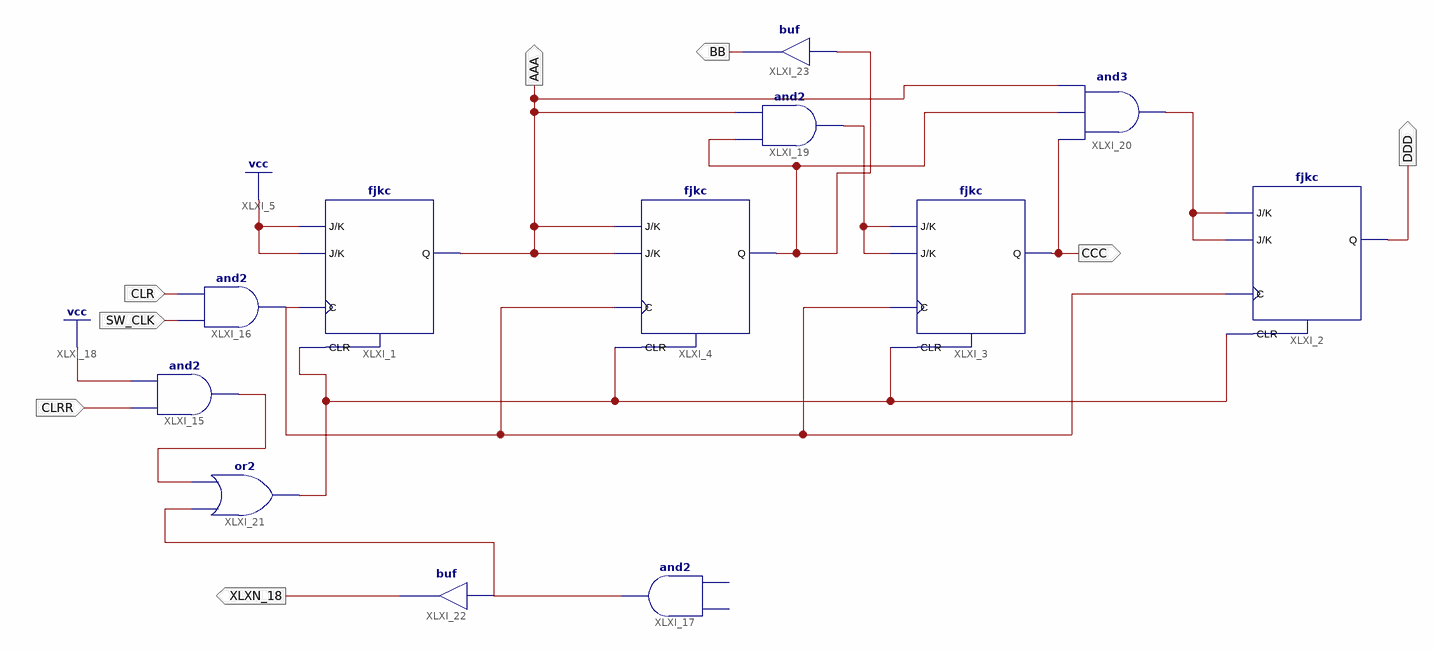
[diagram p0: schematic sheet 1]
// Xilinx ISE schematic COU0_9.sch (spartan6) as structural Verilog: 12 symbols, 8 ports
module COU0_9 (
  input  CLR,
  input  SW_CLK,
  input  CLRR,
  output DDD,
  output AAA,
  output CCC,
  output XLXN_18,
  output BB
);

  wire BBB, OUTCLK, XLXN_1, XLXN_49, XLXN_52, XLXN_56;

  fjkc XLXI_1 (.C(XLXN_1), .CLR(XLXN_56), .J(1'b1), .K(1'b1), .Q(AAA));
  fjkc XLXI_2 (.C(XLXN_1), .CLR(XLXN_56), .J(XLXN_49), .K(XLXN_49), .Q(DDD));
  fjkc XLXI_3 (.C(XLXN_1), .CLR(XLXN_56), .J(BBB), .K(BBB), .Q(CCC));
  fjkc XLXI_4 (.C(XLXN_1), .CLR(XLXN_56), .J(AAA), .K(AAA), .Q(BBB));
  and XLXI_16 (XLXN_1, SW_CLK, CLR);
  // and2 XLXI_17 has open pins: I0=open, I1=open, O=OUTCLK
  and XLXI_19 (BBB, BBB, AAA);
  and XLXI_20 (XLXN_49, CCC, BBB, AAA);
  and XLXI_15 (XLXN_52, CLRR, 1'b1);
  or XLXI_21 (XLXN_56, OUTCLK, XLXN_52);
  buf XLXI_22 (XLXN_18, OUTCLK);
  buf XLXI_23 (BB, BBB);
endmodule
